# EAGLE design Geogram ONE (EAGLE 6.2)
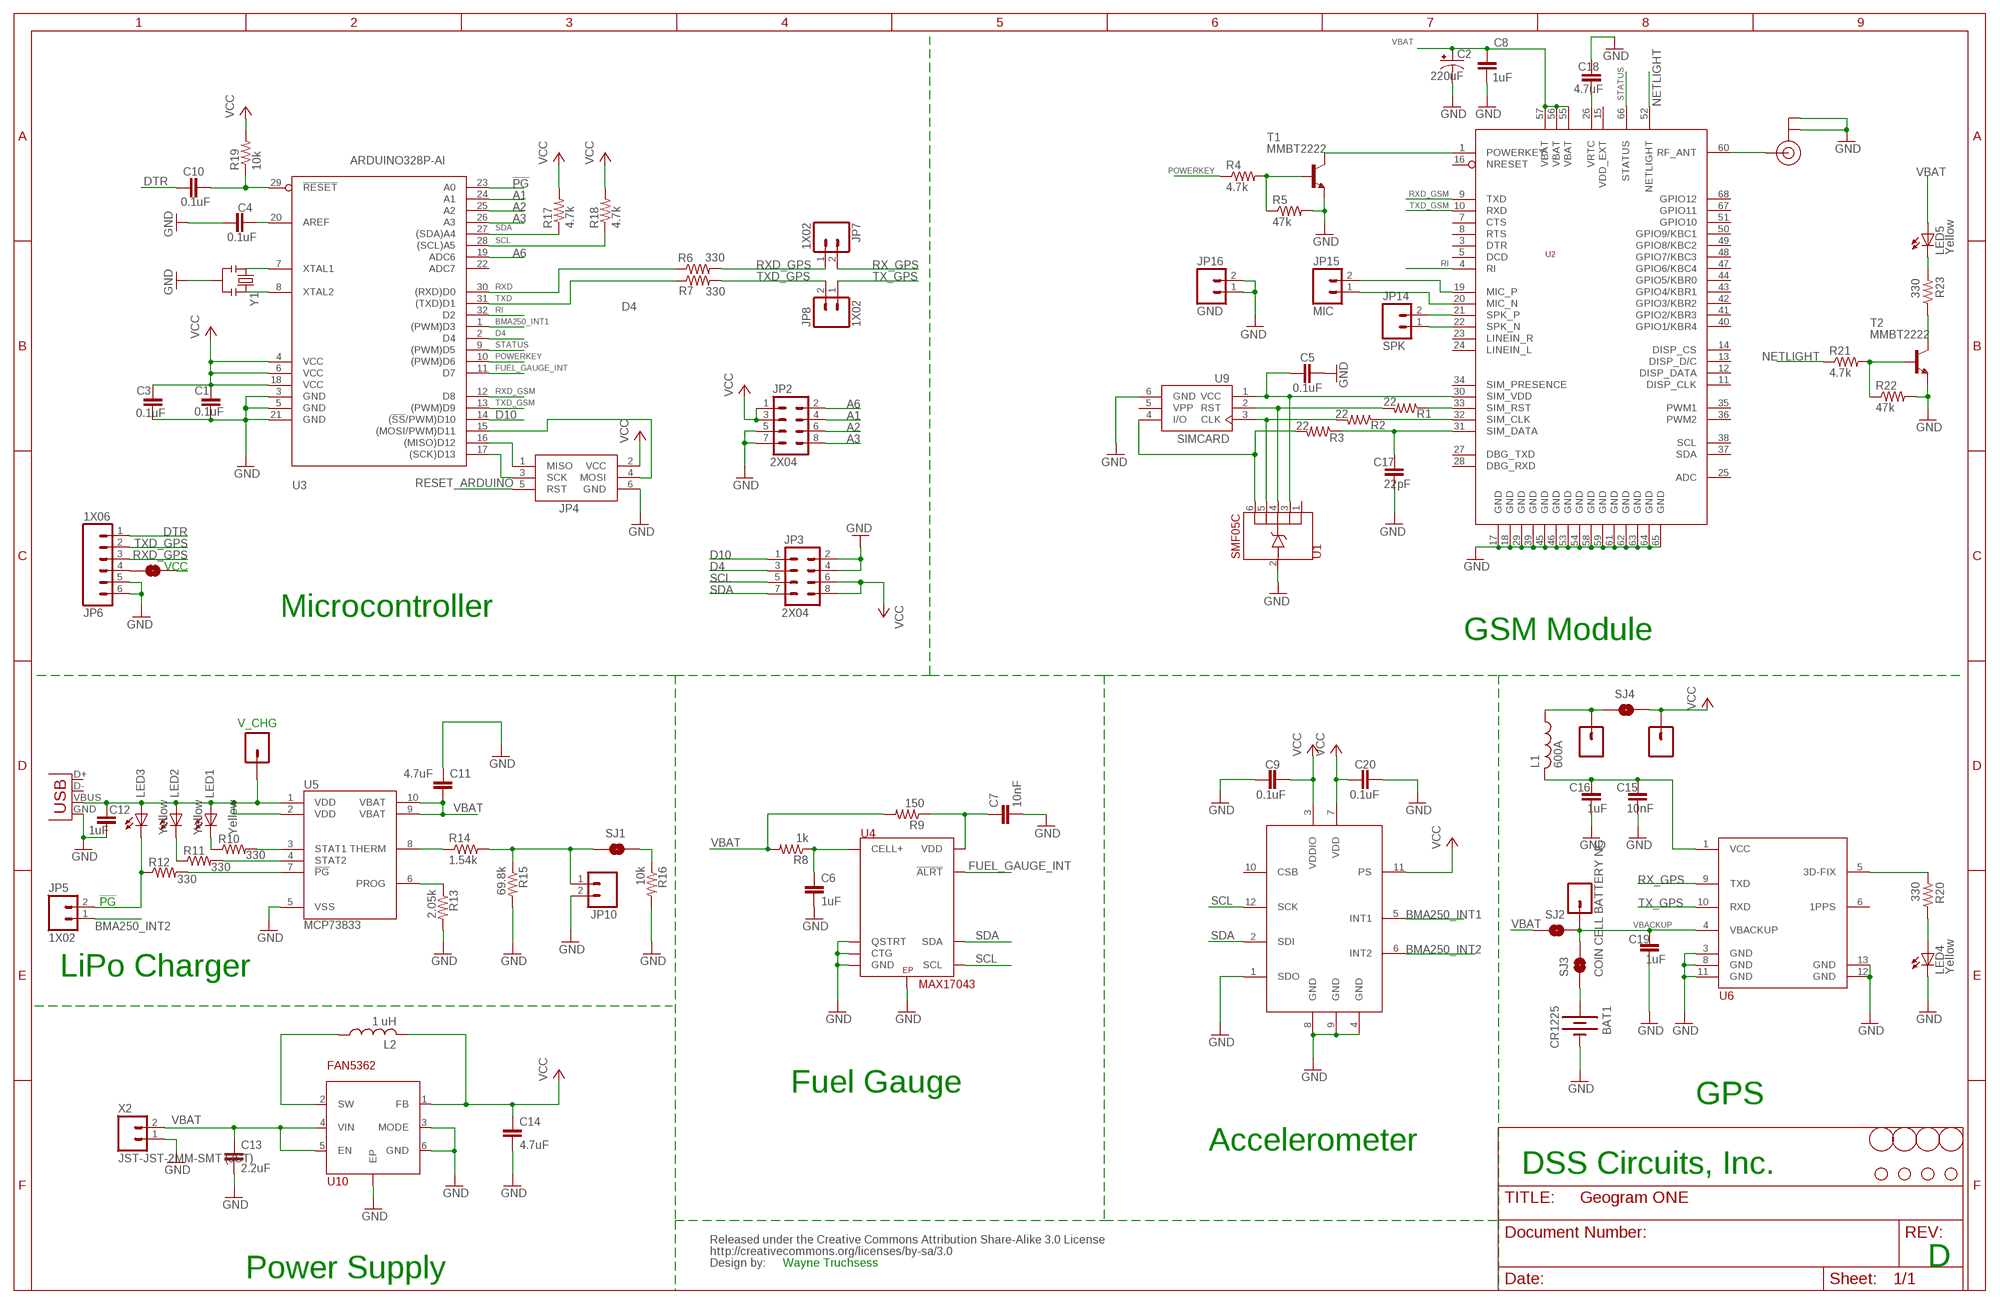
[diagram p0: schematic, sheet 1]

## Parts
BAT1  CR1225  BATTERY12MM  [BATTCON_12MM]
C1  0.1uF  C-EUC0603  [C0603]
C2  220uF  CPOL-USD/7343-31R  [D/7343-31R]
C3  0.1uF  C-EUC0603  [C0603]
C4  0.1uF  C-EUC0603  [C0603]
C5  0.1uF  C-EUC0603  [C0603]
C6  1uF  C-EUC0603  [C0603]
C7  10nF  C-EUC0603  [C0603]
C8  1uF  C-EUC0603  [C0603]
C9  0.1uF  C-EUC0603  [C0603]
C10  0.1uF  C-EUC0603  [C0603]
C11  4.7uF  C-EUC0603  [C0603]
C12  1uF  C-EUC0603  [C0603]
C13  2.2uF  C-EUC0603  [C0603]
C14  4.7uF  C-EUC0603  [C0603]
C15  10nF  C-EUC0603  [C0603]
C16  1uF  C-EUC0603  [C0603]
C17  22pF  C-EUC0603  [C0603]
C18  4.7uF  C-EUC0603  [C0603]
C19  1uF  C-EUC0603  [C0603]
C20  0.1uF  C-EUC0603  [C0603]
FIDUCIAL1  FIDUCIAL  [FIDUCIAL_1MM]
FIDUCIAL2  FIDUCIAL  [FIDUCIAL_1MM]
FIDUCIAL3  FIDUCIAL  [FIDUCIAL_1MM]
FIDUCIAL4  FIDUCIAL  [FIDUCIAL_1MM]
JP2  2X04  M04X2  [2X4]
JP3  2X04  M04X2  [2X4]
JP4  AVRISP-6  [AVRISP]
JP5  1X02  M021X02_NO_SILK  [1X02_NO_SILK]
JP6  1X06  M06SIP  [1X06]
JP7  1X02  M021X02_NO_SILK  [1X02_NO_SILK]
JP8  1X02  M021X02_NO_SILK  [1X02_NO_SILK]
JP9  V_CHG  M01PTH  [1X01]
JP10  EXT THERMISTER  M021X02_NO_SILK  [1X02_NO_SILK]
JP11  EXT_BAT  M01PTH  [1X01]
JP12  EXT GPS POWER JPR  M01PTH  [1X01]
JP13  EXT GPS POWER JPR  M01PTH  [1X01]
JP14  SPK  M021X02_NO_SILK  [1X02_NO_SILK]
JP15  MIC  M021X02_NO_SILK  [1X02_NO_SILK]
JP16  GND  M021X02_NO_SILK  [1X02_NO_SILK]
L1  600A  L-USL2012C  [L2012C]
L2  1 uH  L-USL2012C  [L2012C]
LED1  Yellow  LEDCHIP-LED0603  [CHIP-LED0603]
LED2  Yellow  LEDCHIP-LED0603  [CHIP-LED0603]
LED3  Yellow  LEDCHIP-LED0603  [CHIP-LED0603]
LED4  Yellow  LEDCHIP-LED0603  [CHIP-LED0603]
LED5  Yellow  LEDCHIP-LED0603  [CHIP-LED0603]
LICENSE  CREATIVE_COMMONS  [CREATIVE_COMMONS]
R1  22  R-US_R0603  [R0603]
R2  22  R-US_R0603  [R0603]
R3  22  R-US_R0603  [R0603]
R4  4.7k  R-US_R0603  [R0603]
R5  47k  R-US_R0603  [R0603]
R6  330  R-US_R0603  [R0603]
R7  330  R-US_R0603  [R0603]
R8  1k  R-US_R0603  [R0603]
R9  150  R-US_R0603  [R0603]
R10  330  R-US_R0603  [R0603]
R11  330  R-US_R0603  [R0603]
R12  330  R-US_R0603  [R0603]
R13  2.05k  R-US_R0603  [R0603]
R14  1.54k  R-US_R0603  [R0603]
R15  69.8k  R-US_R0603  [R0603]
R16  10k  R-US_R0603  [R0603]
R17  4.7k  R-US_R0603  [R0603]
R18  4.7k  R-US_R0603  [R0603]
R19  10k  R-US_R0603  [R0603]
R20  330  R-US_R0603  [R0603]
R21  4.7k  R-US_R0603  [R0603]
R22  47k  R-US_R0603  [R0603]
R23  330  R-US_R0603  [R0603]
SJ1  EXT THERMISTER NC  SOLDERJUMPERTRACE  [SJ_2S-TRACE]
SJ2  LIPO BATTERY NO  SOLDERJUMPERNO  [SJ_2S-NO]
SJ3  COIN CELL BATTERY NC  SOLDERJUMPERTRACE  [SJ_2S-TRACE]
SJ4  EXT GPS POWER NC  SOLDERJUMPERTRACE  [SJ_2S-TRACE]
SJ5  EXT VCC NO  SOLDERJUMPERNO  [SJ_2S-NO]
STANDOFF1  STAND-OFF  [STAND-OFF]
STANDOFF2  STAND-OFF  [STAND-OFF]
STANDOFF3  STAND-OFF  [STAND-OFF]
STANDOFF4  STAND-OFF  [STAND-OFF]
T1  MMBT2222  MMBT2222ALT1-NPN-SOT23-BEC  [SOT23-BEC]
T2  MMBT2222  MMBT2222ALT1-NPN-SOT23-BEC  [SOT23-BEC]
U1  SMF05C  [SC70-6L]
U2  SIM900  [SIM900]
U3  ARDUINO328P-AI  [TQFP32-08]
U4  MAX17043  [TDFN8]
U5  MCP73833  [MSOP-10]
U6  PA6C  [PA6C]
U7  BMA250  [12LGA_VGG3-D]
U8  U.FL  [U.FL]
U9  SIMCARD  [SIMCARD]
U10  FAN5362  [UMLP]
X1  USBSMD  [USB-MINIB]
X2  JST-JST-2MM-SMT (JST)  JST-JST-2MM-SMT  [JST]
Y1  8 MHz  RESONATORSMD  [RESONATOR-SMD]

## Nets
!PG: JP5.2 LED3.C R12.1 U3.23(A0)
A1: JP2.4 U3.24(A1)
A2: JP2.6 U3.25(A2)
A3: JP2.8 U3.26(A3)
A6: JP2.2 U3.19(ADC6)
AREF: C4.2 U3.20(AREF)
BMA250_INT1: U3.1((PWM)D3) U7.5(INT1)
BMA250_INT2: JP5.1 U7.6(INT2)
D4: JP3.3 U3.2(D4)
D10: JP3.1 U3.14((!SS!/PWM)D10)
DTR: C10.1 JP6.1
FUEL_GAUGE_INT: U3.11(D7) U4.!ALRT
GND: BAT1.GND(-) C1.2 C2.- C3.2 C4.1 C5.2 C6.2 C7.2 C8.2 C9.2 C11.1 C12.2 C13.2 C14.2 C15.1 C16.1 C17.1 C18.1 C19.1 C20.1 JP2.5 JP2.7 JP3.2 JP3.4 JP4.6(GND) JP6.5 JP6.6 JP10.2 JP16.1 JP16.2 LED4.C R5.2 R13.2 R15.2 R16.2 R22.2 T1.E T2.E U1.2 U2.17(GND) U2.18(GND) U2.29(GND) U2.39(GND) U2.45(GND) U2.46(GND) U2.53(GND) U2.54(GND) U2.58(GND) U2.59(GND) U2.61(GND) U2.62(GND) U2.63(GND) U2.64(GND) U2.65(GND) U3.3(GND) U3.5(GND) U3.21(GND) U4.CTG U4.EP U4.GND U4.QSTRT U5.5(VSS) U6.3(GND) U6.8(GND) U6.11(GND) U6.12(GND) U6.13(GND) U7.1(SDO) U7.4(GND) U7.8(GND) U7.9(GND) U8.P$1(GND) U8.P$2(GND) U9.6(GND) U10.3(MODE) U10.6(GND) U10.7(EP) X1.GND X2.1 Y1.2
MIC_N: JP15.1 U2.20(MIC_N)
MIC_P: JP15.2 U2.19(MIC_P)
MISO: JP4.1(MISO) U3.16((MISO)D12)
MOSI: JP4.4(MOSI) U3.15((MOSI/PWM)D11)
N$2: C18.2 U2.26(VRTC)
N$3: R2.1 U2.32(SIM_CLK)
N$4: R20.2 U6.5(3D-FIX)
N$6: C6.1 R8.1 U4.CELL+
N$7: R1.1 U2.33(SIM_RST)
N$8: C17.2 R3.1 U2.31(SIM_DATA)
N$9: R2.2 U1.5 U9.3(CLK)
N$10: R1.2 U1.4 U9.2(RST)
N$11: R3.2 U1.6 U9.4(I/O)
N$12: LED4.A R20.1
N$13: U2.60(RF_ANT) U8.P$3(SIGNAL)
N$14: T1.C U2.1(POWERKEY)
N$15: R4.2 R5.1 T1.B
N$16: BAT1.PWR@2(+) SJ3.1
N$17: R21.2 R22.1 T2.B
N$18: R23.1 T2.C
N$19: JP6.4 SJ5.2
N$20: C7.1 R9.1 U4.VDD
N$21: LED1.C R10.1
N$22: LED2.C R11.1
N$24: JP12.1 L1.1 SJ4.1 SJ5.1
N$26: R13.1 U5.6(PROG)
N$27: R14.1 U5.8(THERM)
N$28: LED5.C R23.2
N$29: JP10.1 R14.2 R15.1 SJ1.1
N$30: L2.1 U10.2(SW)
N$31: R16.1 SJ1.2
NETLIGHT: R21.1 U2.52(NETLIGHT)
PG: R12.2 U5.7(!PG)
POWERKEY: R4.1 U3.10((PWM)D6)
RESET_ARDUINO: C10.2 JP4.5(RST) R19.1 U3.29(!RESET)
RI: U2.4(RI) U3.32(D2)
RX_GPS: JP7.2 U6.9(TXD)
RXD: R6.1 U3.30((RXD)D0)
RXD_GPS: JP6.3 JP7.1 R6.2
RXD_GSM: U2.9(TXD) U3.12(D8)
SCK: JP4.3(SCK) U3.17((SCK)D13)
SCL: JP3.5 R18.1 U3.28((SCL)A5) U4.SCL U7.12(SCK)
SDA: JP3.7 R17.1 U3.27((SDA)A4) U4.SDA U7.2(SDI)
SIM_VDD: C5.1 U1.3 U2.30(SIM_VDD) U9.1(VCC)
SPK_N: JP14.1 U2.22(SPK_N)
SPK_P: JP14.2 U2.21(SPK_P)
STAT1: R10.2 U5.3(STAT1)
STAT2: R11.2 U5.4(STAT2)
STATUS: U2.66(STATUS) U3.9((PWM)D5)
TX_GPS: JP8.1 U6.10(RXD)
TXD: R7.1 U3.31((TXD)D1)
TXD_GPS: JP6.2 JP8.2 R7.2
TXD_GSM: U2.10(RXD) U3.13((PWM)D9)
VBACKUP: C19.2 JP11.1 SJ2.2 SJ3.2 U6.4(VBACKUP)
VBAT: C2.+ C8.1 C11.2 C13.1 LED5.A R8.2 R9.2 SJ2.1 U2.55(VBAT) U2.56(VBAT) U2.57(VBAT) U5.9(VBAT) U5.10(VBAT) U10.4(VIN) U10.5(EN) X2.2
VBUS: C12.1 JP9.1 LED1.A LED2.A LED3.A U5.1(VDD) U5.2(VDD) X1.VBUS
VCC: C1.1 C3.1 C9.1 C14.1 C20.2 JP2.1 JP2.3 JP3.6 JP3.8 JP4.2(VCC) JP13.1 L2.2 R17.2 R18.2 R19.2 SJ4.2 U3.4(VCC) U3.6(VCC) U3.18(VCC) U7.3(VDDIO) U7.7(VDD) U7.11(PS) U10.1(FB)
VCC_GPS: C15.2 C16.2 L1.2 U6.1(VCC)
XTAL1: U3.7(XTAL1) Y1.1
XTAL2: U3.8(XTAL2) Y1.3
Unconnected: U1.1 U2.2(NC) U2.3(DTR) U2.5(DCD) U2.6(NC) U2.7(CTS) U2.8(RTS) U2.11(DISP_CLK) U2.12(DISP_DATA) U2.13(DISP_D/C) U2.14(DISP_CS) U2.16(NRESET) U2.23(LINEIN_R) U2.24(LINEIN_L) U2.25(ADC) U2.27(DBG_TXD) U2.28(DBG_RXD) U2.34(SIM_PRESENCE) U2.35(PWM1) U2.36(PWM2) U2.37(SDA) U2.38(SCL) U2.40(GPIO1/KBR4) U2.41(GPIO2/KBR3) U2.42(GPIO3/KBR2) U2.43(GPIO4/KBR1) U2.44(GPIO5/KBR0) U2.47(GPIO6/KBC4) U2.48(GPIO7/KBC3) U2.49(GPIO8/KBC2) U2.50(GPIO9/KBC1) U2.51(GPIO10) U2.67(GPIO11) U2.68(GPIO12) U3.22(ADC7) U6.2(NC) U6.6(1PPS) U6.7(NC) U7.10(CSB) X1.D+ X1.D-

## Notes on the sheet
- VCC
- Microcontroller
- GSM Module
- V_CHG
- !PG
- LiPo Charger
- Fuel Gauge
- GPS
- Accelerometer
- DSS Circuits, Inc.
- Wayne Truchsess | D
- Power Supply

## Power pins joined to a net without a drawn wire
VDD_EXT: U2.15(VDD_EXT)
VPP: U9.5(VPP)

## Library data of the parts
BAT1 = SparkFun:BATTERY: Battery Holders Various common sizes : AA, AAA, 20mm coin cell and 12mm coin cell.; DIGIKEY#: 3000KTR-ND; MANF: Keystone Electronics; MANF#: 3000TR; MOUSER#: 534-3000TR
C1 C3-C5 C9 C10 C20 = resistor:C-EU: CAPACITOR, European symbol; DIGIKEY#: 399-1095-2-ND; MANF: Kemet; MANF#: C0603C104K8RACTU; MOUSER#: 80-C0603C104K8R
C2 = resistor:CPOL-US: POLARIZED CAPACITOR, American symbol; DIGIKEY#: 399-4045-2-ND; MANF: Kemet; MANF#: T520D227M010ATE018; MOUSER#: 80-T520D227M010
C6 C8 C12 C16 C19 = resistor:C-EU: CAPACITOR, European symbol; DIGIKEY#: 445-1321-2-ND; MANF: TDK; MANF#: C1608X5R1A105KT; MOUSER#: 810-C1608X5R1A105K
C7 C15 = resistor:C-EU: CAPACITOR, European symbol; MANF: Vishay/Vitramon; MANF#: VJ0603Y103KXQCW1BC; MOUSER#: 77-VJ0603Y103KXQCBC
C11 C14 C18 = resistor:C-EU: CAPACITOR, European symbol; DIGIKEY#: 399-3482-2-ND; MANF: Kemet; MANF#: C0603C475K9PACTU; MOUSER#: 80-C0603C475K9P
C13 = resistor:C-EU: CAPACITOR, European symbol; DIGIKEY#: 399-3362-2-ND; MANF: Kemet; MANF#: C0603C225K9PACTU; MOUSER#: 80-C0603C225K9P
C17 = resistor:C-EU: CAPACITOR, European symbol; MANF: Vishay/Vitramon; MANF#: VJ0603A220KXJPW1BC; MOUSER#: 77-VJ0603A220KXJPBC
FIDUCIAL1-FIDUCIAL4 = adafruit:FIDUCIAL: For use by pick and place machines to calibrate the vision/machine, 1mm By microbuilder.eu
JP2 JP3 = SparkFun:M04X2; MANF: 4Ucon; MANF#: 0991
JP4 = adafruit:AVRISP: AVR ISP HEADER Standard 6 pin header for AVR programming; MANF: 4Ucon; MANF#: 0989
JP5 JP7 JP8 = SparkFun:M02: Header 2 Standard 2-pin 0.1" header. Use with straight break away headers (SKU : PRT-00116), right angle break away headers (PRT-00553), swiss pins (PRT-00743), machine pins (PRT-00117), and female headers (PRT-00115). Molex polarized connector foot print use with SKU : PRT-08233 with associated crimp pins and housings.; MANF: 4Ucon; MANF#: 0795
JP6 = SparkFun:M06: Header 6 Standard 6-pin 0.1" header. Use with straight break away headers (SKU : PRT-00116), right angle break away headers (PRT-00553), swiss pins (PRT-00743), machine pins (PRT-00117), and female headers (PRT-00115). Molex polarized connector foot print use with SKU : PRT-08094 with associated crimp pins and housings. NOTES ON THE VARIANTS LOCK and LOCK_LONGPADS... This footprint was designed to help hold the alignment of a through-hole component (i.e. 6-pin header) while soldering it into place. You may notice that each hole has been shifted either up or down by 0.005 of an inch from it's more standard position (which is a perfectly straight line). This slight alteration caused the pins (the squares in the middle) to touch the edges of the holes. Because they are alternating, it causes a "brace" to hold the component in place. 0.005 has proven to be the perfect amount of "off-center" position when using our standard breakaway headers. Although looks a little odd when you look at the bare footprint, once you have a header in there, the alteration is very hard to notice. Also, if you push a header all the way into place, it is covered up entirely on the bottom side. This idea of altering the position of holes to aid alignment will be further integrated into the Sparkfun Library for other footprints. It can help hold any component with 3 or more connection pins.; MANF: 4Ucon; MANF#: 0808
JP9 JP11-JP13 = SparkFun:M01: Header 1 Standard 1-pin 0.1" header. Use with straight break away headers (SKU : PRT-00116), right angle break away headers (PRT-00553), swiss pins (PRT-00743), machine pins (PRT-00117), and female headers (PRT-00115).
JP10 JP14-JP16 = SparkFun:M02: Header 2 Standard 2-pin 0.1" header. Use with straight break away headers (SKU : PRT-00116), right angle break away headers (PRT-00553), swiss pins (PRT-00743), machine pins (PRT-00117), and female headers (PRT-00115). Molex polarized connector foot print use with SKU : PRT-08233 with associated crimp pins and housings.
L1 = resistor:L-US: INDUCTOR, American symbol; MANF: TDK; MANF#: MMZ2012R601AT; MOUSER#: 810-MMZ2012R601A
L2 = resistor:L-US: INDUCTOR, American symbol; DIGIKEY#: 490-4992-2-ND; MANF: Murata; MANF#: LQM21PN1R0MC0D; MOUSER#: 81-LQM21PN1R0MC0D
LED1-LED5 = led:LED: LED OSRAM: - CHIPLED LG R971, LG N971, LY N971, LG Q971, LY Q971, LO R971, LY R971 LH N974, LH R974 LS Q976, LO Q976, LY Q976 LO Q996 - Hyper CHIPLED LW Q18S LB Q993, LB Q99A, LB R99A - SideLED LS A670, LO A670, LY A670, LG A670, LP A670 LB A673, LV A673, LT A673, LW A673 LH A674 LY A675 LS A676, LA A676, LO A676, LY A676, LW A676 LS A679, LY A679, LG A679 - Hyper Micro SIDELED® LS Y876, LA Y876, LO Y876, LY Y876 LT Y87S - SmartLED LW L88C, LW L88S LB L89C, LB L89S, LG L890 LS L89K, LO L89K, LY L89K LS L896, LA L896, LO L896, LY L896 - TOPLED LS T670, LO T670, LY T670, LG T670, LP T670 LSG T670, LSP T670, LSY T670, LOP T670, LYG T670 LG T671, LOG T671, LSG T671 LB T673, LV T673, LT T673, LW T673 LH T674 LS T676, LA T676, LO T676, LY T676, LB T676, LH T676, LSB T676, LW T676 LB T67C, LV T67C, LT T67C, LS T67K, LO T67K, LY T67K, LW E67C LS E67B, LA E67B, LO E67B, LY E67B, LB E67C, LV E67C, LT E67C LW T67C LS T679, LY T679, LG T679 LS T770, LO T770, LY T770, LG T770, LP T770 LB T773, LV T773, LT T773, LW T773 LH T774 LS E675, LA E675, LY E675, LS T675 LS T776, LA T776, LO T776, LY T776, LB T776 LHGB T686 LT T68C, LB T68C - Hyper Mini TOPLED® LB M676 - Mini TOPLED Santana® LG M470 LS M47K, LO M47K, LY M47K Source: http://www.osram.convergy.de LUXEON: - LUMILED® LXK2-PW12-R00, LXK2-PW12-S00, LXK2-PW14-U00, LXK2-PW14-V00 LXK2-PM12-R00, LXK2-PM12-S00, LXK2-PM14-U00 LXK2-PE12-Q00, LXK2-PE12-R00, LXK2-PE12-S00, LXK2-PE14-T00, LXK2-PE14-U00 LXK2-PB12-K00, LXK2-PB12-L00, LXK2-PB12-M00, LXK2-PB14-N00, LXK2-PB14-P00, LXK2-PB14-Q00 LXK2-PR12-L00, LXK2-PR12-M00, LXK2-PR14-Q00, LXK2-PR14-R00 LXK2-PD12-Q00, LXK2-PD12-R00, LXK2-PD12-S00 LXK2-PH12-R00, LXK2-PH12-S00 LXK2-PL12-P00, LXK2-PL12-Q00, LXK2-PL12-R00 Source: www.luxeon.com KINGBRIGHT: KA-3528ASYC Source: www.kingbright.com; DIGIKEY#: 475-2557-2-ND; MANF: OSRAM Opto Semiconductors; MANF#: LY Q971-H1K1-36; MOUSER#: 720-LYQ971H1K136
LICENSE = SparkFun:CREATIVE_COMMONS
R1-R3 = resistor:R-US_: RESISTOR, American symbol; DIGIKEY#: P22.0HTR-ND; MANF: Panasonic Electronic Components; MANF#: ERJ-3EKF22R0V; MOUSER#: 667-ERJ-3EKF22R0V
R4 R17 R18 R21 = resistor:R-US_: RESISTOR, American symbol; DIGIKEY#: P4.70KHTR-ND; MANF: Panasonic Electronic Components; MANF#: ERJ-3EKF4701V; MOUSER#: 667-ERJ-3EKF4701V
R5 R22 = resistor:R-US_: RESISTOR, American symbol; DIGIKEY#: P47.0KHTR-ND; MANF: Panasonic Electronic Components; MANF#: ERJ-3EKF4702V; MOUSER#: 667-ERJ-3EKF4702V
R6 R7 R10-R12 R20 R23 = resistor:R-US_: RESISTOR, American symbol; DIGIKEY#: P330HTR-ND; MANF: Panasonic Electronic Components; MANF#: ERJ-3EKF3300V; MOUSER#: 667-ERJ-3EKF3300V
R8 = resistor:R-US_: RESISTOR, American symbol; DIGIKEY#: P1.00KHTR-ND; MANF: Panasonic Electronic Components; MANF#: ERJ-3EKF1001V; MOUSER#: 667-ERJ-3EKF1001V
R9 = resistor:R-US_: RESISTOR, American symbol; DIGIKEY#: P150HTR-ND; MANF: Panasonic Electronic Components; MANF#: ERJ-3EKF1500V; MOUSER#: 667-ERJ-3EKF1500V
R13 = resistor:R-US_: RESISTOR, American symbol; DIGIKEY#: P2.05KHTR-ND; MANF: Panasonic Electronic Components; MANF#: ERJ-3EKF2051V; MOUSER#: 667-ERJ-3EKF2051V
R14 = resistor:R-US_: RESISTOR, American symbol; DIGIKEY#: 541-1.54KHTR-ND; MANF: Vishay/Dale; MANF#: CRCW06031K54FKEA; MOUSER#: 71-CRCW0603-1.54K-E3
R15 = resistor:R-US_: RESISTOR, American symbol; DIGIKEY#: P69.8KHTR-ND; MANF: Panasonic Electronic Components; MANF#: ERJ-3EKF6982V; MOUSER#: 667-ERJ-3EKF6982V
R16 R19 = resistor:R-US_: RESISTOR, American symbol; DIGIKEY#: P10.0KHTR-ND; MANF: Panasonic Electronic Components; MANF#: ERJ-3EKF1002V; MOUSER#: 667-ERJ-3EKF1002V
SJ1-SJ5 = SparkFun:SOLDERJUMPER: Solder Jumper Standard SMD solder jumper. Used to automate production. Two varients : Normally Open and Normally Closed are the same, but have different paste layers. NC will have a large amount of paste and should jumper during reflow.
STANDOFF1-STANDOFF4 = DSSCircuits:STAND-OFF: Stand Off This is the mechanical footprint for a #4 phillips button head screw. Use the keepout ring to avoid running the screw head into surrounding components. SKU : PRT-00447
T1 T2 = transistor:*-NPN-: NPN Transistror BF959 corrected 2008.03.06; DIGIKEY#: MMBT2222AFSTR-ND; MANF: Fairchild Semiconductor; MANF#: MMBT2222A; MOUSER#: 512-MMBT2222A
U1 = DSSCircuits:SMF05C; DIGIKEY#: SMF05CTR-ND; MANF: Semtech; MANF#: SMF05C.TCT
U2 = DSSCircuits:SIM900; MANF: Simcom; MANF#: SIM900
U3 = DSSCircuits:ARDUINO328P: MICROCONTROLLER 8 Kbytes FLASH 1 kbytes SRAM 512 bytes EEPROM USART 6-channel 10 bit ADC 2-channel 8 bit ADC; DIGIKEY#: ATMEGA328P-AU-ND; MANF: Atmel; MANF#: ATMEGA328P-AU; MOUSER#: 556-ATMEGA328P-AU
U4 = DSSCircuits:MAX17043: Compact, Low-Cost 1S Fuel Gauges with Low-Battery Alert; DIGIKEY#: MAX17043G+T-ND; MANF: Maxim Integrated Products; MANF#: MAX17043G+T; MOUSER#: 700-MAX17043G+T
U5 = SparkFun:MCP73833: Microchip MCP73833 Stand-alone Linear Li-ion/Li-polymer Charge Management Controller Packages: DFN-10, MSOP-10 Last modified: 8/17/10 Unproven!; DIGIKEY#: MCP73833-FCI/UN-ND; MANF: Microchip Technology; MANF#: MCP73833-FCI/UN; MOUSER#: 579-MCP73833-FCI/UN
U6 = DSSCircuits:PA6C; MANF: GlobalTop Inc.; MANF#: PA6C
U7 = DSSCircuits:BMA250; DIGIKEY#: 828-1023-6-ND; MANF: Bosch Sensortec; MANF#: BMA250
U8 = DSSCircuits:U.FL; DIGIKEY#: 931-1107-2-ND; MANF: Taoglas; MANF#: RECE-20279-001E-01; MOUSER#: 960-RECE20279001E01
U9 = DSSCircuits:SIMCARD; DIGIKEY#: 609-1401-2-ND; MANF: FCI; MANF#: 7111S2015X02LF; MOUSER#: 649-7111S2015X02LF
U10 = DSSCircuits:FAN5362; DIGIKEY#: FAN5362UMP33X-ND; MANF: Fairchild Semiconductor; MANF#: FAN5362UMP33X; MOUSER#: 512-FAN5362UMP33X
X1 = SparkFun:USB: USB Connectors USB-B-PTH is fully proven SKU : PRT-00139 USB-miniB is fully proven SKU : PRT-00587 USB-A-PCB is untested. USB-A-H is throughly reviewed, but untested. Spark Fun Electronics SKU : PRT-00437 USB-B-SMT is throughly reviewed, but untested. Needs silkscreen touching up. USB-A-S has not been used/tested USB-MB-H has not been used/tested; DIGIKEY#: ED2992TR-ND; MANF: On Shore Technology Inc; MANF#: USB-M26FTR
X2 = DSSCircuits:JST: JST SMD Connector; DIGIKEY#: 455-1749-2-ND; MANF: 4Ucon; MANF#: 19108
Y1 = DSSCircuits:RESONATOR: Resonator Small SMD resonator. This is the itty bitty 10/20MHz resonators with built in caps. CSTCE10M0G55 and CSTCE20M0V53. Footprint has been reviewed closely but hasn't been tested yet.; MANF: Murata; MANF#: CSTCE8M00G52Z-R0; MOUSER#: 81-CSTCE8M00G52Z-R0

## Board
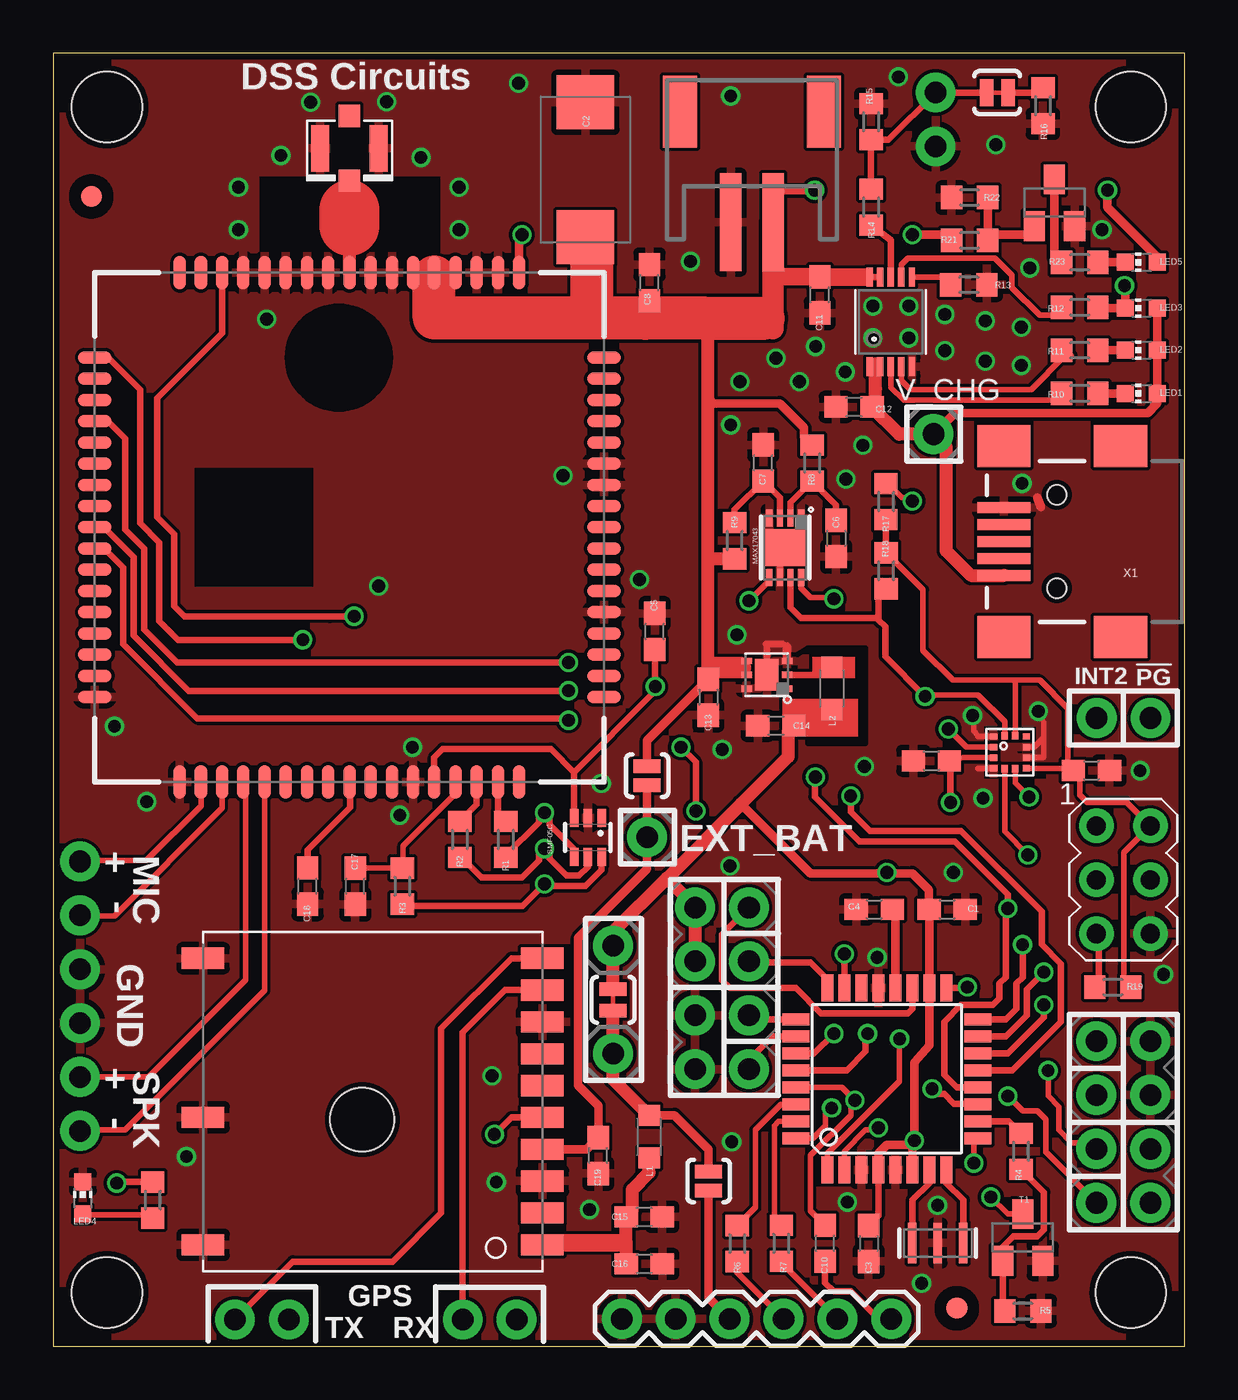
[diagram p1: board, top side]
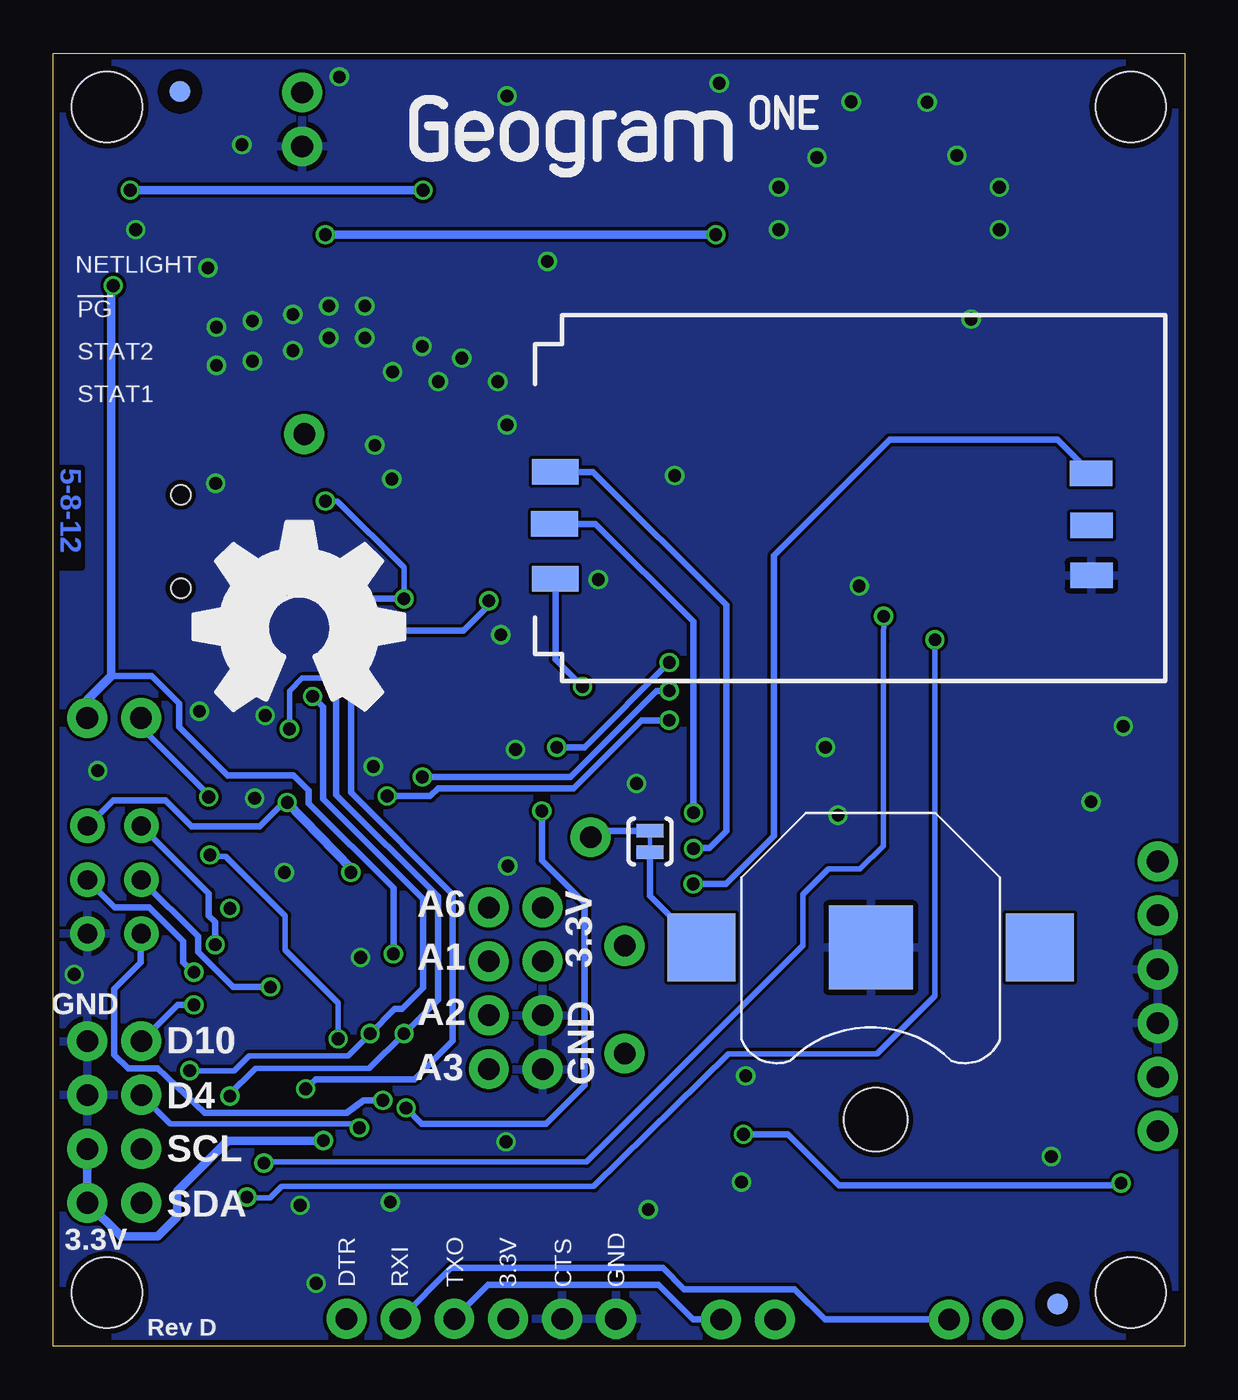
[diagram p2: board, bottom side, seen from below]

Size 53.34 x 60.96 mm. Coordinates in mm from the lower left corner, seen from the top.
Outline: 0,0 53.34,0 53.34,60.96 0,60.96 0,0
Copper layers (1*16): Top 0.035mm / dielectric 1.5mm / Bottom 0.035mm
Design rules: minimum track width 6mil, minimum drill 12mil, track to track 6mil, track to pad 6mil, pad to pad 6mil, via to via 6mil, smd to smd 0mil, copper to edge 10mil, drill to drill 10mil, minimum pad ring 10mil, minimum via ring 6mil, stop-mask expansion 2mil, vias tented up to drill 100mil, thermal gap 10mil
tRestrict: area 9.7,51.6 to 18.2,55.1; 17 lines
bRestrict: 2 lines

### Footprints (pad centres in the part's own frame; a part is rotated, then mirrored left to right if it is on the bottom)
BATTCON_12MM = smd 3.962 x 3.962: GND 0,0 | smd 3.2 x 3.2: PWR@1 -7.974,0; PWR@2 7.974,0
C0603 = smd 1.1 x 1: 1 -0.85,0; 2 0.85,0
D/7343-31R = smd 2.55 x 2.7: + 3.175,0; - -3.175,0
FIDUCIAL_1MM = smd 1 x 1: 1 0,0
2X4 = drill 1.016 pad 1.88: 1 -3.81,-1.27; 2 -3.81,1.27; 3 -1.27,-1.27; 4 -1.27,1.27; 5 1.27,-1.27; 6 1.27,1.27; 7 3.81,-1.27; 8 3.81,1.27
AVRISP = drill 0.9 pad 1.626: 1 -1.27,2.54; 2 1.27,2.54; 3 -1.27,0; 4 1.27,0; 5 -1.27,-2.54; 6 1.27,-2.54
1X02_NO_SILK = drill 1.016 pad 1.88: 1 0,0; 2 2.54,0
1X06 = drill 1.016 pad 1.88: 1 0,0; 2 2.54,0; 3 5.08,0; 4 7.62,0; 5 10.16,0; 6 12.7,0
1X01 = drill 1.016 pad 1.88: 1 0,0
L2012C = smd 1 x 1: 1 -1,0; 2 1,0
CHIP-LED0603 = smd 0.8 x 0.8: A 0,-0.75; C 0,0.75
R0603 = smd 1 x 1.1: 1 -0.85,0; 2 0.85,0
SJ_2S-TRACE = smd 0.635 x 1.27: 1 -0.508,0; 2 0.508,0
SJ_2S-NO = smd 0.635 x 1.27: 1 -0.45,0; 2 0.45,0
STAND-OFF = hole 3.302: 0,0
SOT23-BEC = smd 1 x 1.4: B -0.95,-1.1; C 0,1.1; E 0.95,-1.1
SC70-6L = smd 0.85 x 0.4: 1 -0.925,0.65; 2 -0.925,0; 3 -0.925,-0.65; 4 0.925,-0.65; 5 0.925,0; 6 0.925,0.65
SIM900 = smd 1.6 x 0.6: 1 -12,8; 2 -12,7; 3 -12,6; 4 -12,5; 5 -12,4; 6 -12,3; 7 -12,2; 8 -12,1; 9 -12,0; 10 -12,-1; 11 -12,-2; 12 -12,-3; 13 -12,-4; 14 -12,-5; 15 -12,-6; 16 -12,-7; 17 -12,-8; 35 12,-8; 36 12,-7; 37 12,-6; 38 12,-5; 39 12,-4; 40 12,-3; 41 12,-2; 42 12,-1; 43 12,0; 44 12,1; 45 12,2; 46 12,3; 47 12,4; 48 12,5; 49 12,6; 50 12,7; 51 12,8 | smd 0.6 x 1.6: 18 -8,-12; 19 -7,-12; 20 -6,-12; 21 -5,-12; 22 -4,-12; 23 -3,-12; 24 -2,-12; 25 -1,-12; 26 0,-12; 27 1,-12; 28 2,-12; 29 3,-12; 30 4,-12; 31 5,-12; 32 6,-12; 33 7,-12; 34 8,-12; 52 8,12; 53 7,12; 54 6,12; 55 5,12; 56 4,12; 57 3,12; 58 2,12; 59 1,12; 60 0,12; 61 -1,12; 62 -2,12; 63 -3,12; 64 -4,12; 65 -5,12; 66 -6,12; 67 -7,12; 68 -8,12
TQFP32-08 = smd 1.27 x 0.559: 1 -4.293,2.8; 2 -4.293,2; 3 -4.293,1.2; 4 -4.293,0.4; 5 -4.293,-0.4; 6 -4.293,-1.2; 7 -4.293,-2; 8 -4.293,-2.8; 17 4.293,-2.8; 18 4.293,-2; 19 4.293,-1.2; 20 4.293,-0.4; 21 4.293,0.4; 22 4.293,1.2; 23 4.293,2; 24 4.293,2.8 | smd 0.559 x 1.27: 9 -2.8,-4.293; 10 -2,-4.293; 11 -1.2,-4.293; 12 -0.4,-4.293; 13 0.4,-4.293; 14 1.2,-4.293; 15 2,-4.293; 16 2.8,-4.293; 25 2.8,4.293; 26 2,4.293; 27 1.2,4.293; 28 0.4,4.293; 29 -0.4,4.293; 30 -1.2,4.293; 31 -2,4.293; 32 -2.8,4.293
TDFN8 = smd 0.8 x 0.3: !ALRT 1.4,-0.75; CELL+ -1.4,0.25; CTG -1.4,0.75; GND -1.4,-0.75; QSTRT 1.4,-0.25; SCL 1.4,0.25; SDA 1.4,0.75; VDD -1.4,-0.25 | smd 1.73 x 1.88: EP 0,0
MSOP-10 = smd 0.305 x 0.889: 1 -1,-2.11; 2 -0.5,-2.11; 3 0,-2.11; 4 0.5,-2.11; 5 1,-2.11; 6 1,2.11; 7 0.5,2.11; 8 0,2.11; 9 -0.5,2.11; 10 -1,2.11
PA6C = smd 2 x 1: 1 -8,6.75; 2 -8,5.25; 3 -8,3.75; 4 -8,2.25; 5 -8,0.75; 6 -8,-0.75; 7 -8,-2.25; 8 -8,-3.75; 9 -8,-5.25; 10 -8,-6.75; 11 8,-6.75; 12 8,0.75; 13 8,6.75 | hole 3: 0.5,0.85
12LGA_VGG3-D = smd 0.35 x 0.3: 1 -0.775,0.75; 2 -0.775,0.25; 3 -0.775,-0.25; 4 -0.775,-0.75; 7 0.775,-0.75; 8 0.775,-0.25; 9 0.775,0.25; 10 0.775,0.75 | smd 0.3 x 0.35: 5 -0.25,-0.775; 6 0.25,-0.775; 11 0.25,0.775; 12 -0.25,0.775
U.FL = smd 2.2 x 0.85: P$1 0,1.375; P$2 0,-1.375 | smd 1.05 x 1: P$3 1.525,0; P$4 -1.525,0
SIMCARD = smd 2.2 x 1.2: 1 0.95,4.81; 2 0.91,7.41; 3 0.95,9.86 | smd 2 x 1.2: 4 26.2,9.78; 5 26.22,7.34; 6 26.22,4.98
UMLP = smd 0.3 x 0.5: 1 -0.65,-0.95; 2 0,-0.95; 3 0.65,-0.95; 4 0.65,0.95; 5 0,0.95; 6 -0.65,0.95 | smd 1.5 x 1.1: 7 0,0
USB-MINIB = smd 2.5 x 0.5: D+ 2.5,0; D- 2.5,0.8; GND 2.5,-1.6; ID 2.5,-0.8; VBUS 2.5,1.6 | smd 2.5 x 2: MTN1 -3,4.5; MTN2 2.5,4.5; MTN3 -3,-4.5; MTN4 2.5,-4.5 | hole 0.9: 0,2.2; 0,-2.2
JST = smd 1 x 4.6: 1 -1,-3.7; 2 1,-3.7 | smd 1.6 x 3.4: NC1 -3.4,1.5; NC2 3.4,1.5
RESONATOR-SMD = smd 0.4 x 1.9: 1 -1.2,0; 2 0,0; 3 1.2,0

### Placement (x,y rotation side)
BAT1  14.8,18.8 180 bottom
C1  42.14,20.6 0 top
C2  25.09,55.46 270 top
C3  38.44,4.86 270 top
C4  38.71,20.6 0 top
C5  28.36,33.7 90 top
C6  36.91,38.08 270 top
C7  33.47,41.64 90 top
C8  28.11,50.14 90 top
C9  48.94,27.15 0 top
C10  36.39,4.86 90 top
C11  36.14,49.56 90 top
C12  37.75,44.28 180 top
C13  30.88,30.6 270 top
C14  34.07,29.25 180 top
C15  27.86,6.11 180 top
C16  27.87,3.89 180 top
C17  14.25,21.69 90 top
C18  12,21.7 90 top
C19  25.7,9 90 top
C20  41.4,27.6 0 top
FIDUCIAL1  42.6,1.8 0 top
FIDUCIAL2  1.8,54.2 0 top
FIDUCIAL3  6,2 0 bottom
FIDUCIAL4  47.36,59.15 0 bottom
JP2  31.53,16.88 270 top
JP3  50.45,10.58 270 top
JP4  50.45,22 0 top
JP5  49.19,29.62 0 top
JP6  39.51,1.3 180 top
JP7  21.85,1.27 180 top
JP8  8.57,1.27 0 top
JP9  41.5,43 0 top
JP10  41.6,59.1 270 top
JP11  28,24 0 top
JP12  26.4,13.8 0 top
JP13  26.4,18.88 0 top
JP14  1.27,10.16 90 top
JP15  1.27,20.32 90 top
JP16  1.27,17.78 270 top
L1  28.1,9.89 270 top
L2  36.71,31.01 270 top
LED1  51.3,44.92 90 top
LED2  51.3,46.96 90 top
LED3  51.3,48.94 90 top
LED4  1.4,7 0 top
LED5  51.3,51.1 90 top
LICENSE  2.88,63.58 0 top
R1  21.34,23.9 270 top
R2  19.18,23.89 270 top
R3  16.47,21.69 270 top
R4  45.62,9.2 270 top
R5  45.71,1.67 0 top
R6  32.25,4.85 270 top
R7  34.33,4.86 270 top
R8  35.78,41.63 90 top
R9  32.12,37.98 270 top
R10  48.39,44.92 180 top
R11  48.39,46.95 180 top
R12  48.39,48.97 180 top
R13  43.16,50.04 0 top
R14  38.56,53.7 90 top
R15  38.56,57.72 90 top
R16  46.66,58.48 270 top
R17  39.26,39.82 270 top
R18  39.26,36.56 90 top
R19  49.95,16.94 0 top
R20  4.7,6.9 90 top
R21  43.2,52.13 0 top
R22  43.2,54.15 180 top
R23  48.39,51.1 0 top
SJ1  44.5,59.1 0 top
SJ2  28,26.9 270 top
SJ3  25.2,23.8 90 bottom
SJ4  26.4,16.34 90 top
SJ5  30.9,7.8 270 top
STANDOFF1  50.8,58.42 0 top
STANDOFF2  2.54,58.42 0 top
STANDOFF3  50.8,2.54 0 top
STANDOFF4  2.54,2.54 0 top
T1  45.71,5.14 0 top
T2  47.2,53.9 0 top
U1  25.21,23.99 270 top
U2  13.97,38.61 0 top
U3  39.3,12.61 90 top
U4  34.51,37.65 270 top
U5  39.48,48.29 0 top
U6  15.07,11.55 180 top
U7  45.1,28 0 top
U8  13.97,56.47 270 top
U9  30.61,31.36 0 bottom
U10  33.64,31.66 90 top
U$10  [OSHW_FILLX350_NOTEXT]  46.7,30 0 bottom
U$11  [GEOGRAM_ONE_LOGO]  36.54,55.1 0 bottom
X1  47.32,37.94 180 top
X2  32.94,56.69 0 top
Y1  41.7,4.87 0 top

### Tracks (layer width: path | path; a pad name or v marks a point on that pad's centre or on a via)
!PG  (via drill 0.6)
  Top 0.254: 49.36,48.94 R12.1
  Top 0.305: U3.23 v37.3,18.5
  Top 0.406: 49.36,48.94 LED3.C 50.55,49.95 v50.5,50
  Bottom 0.305: v37.3,18.5 37.3,21.6 41.3,25.6 41.3,26.2 42,26.9 45.1,26.9 47.4,29.2 47.4,30.3 48.7,31.6 50.6,31.6
  Bottom 0.406: v50.5,50 50.6,49.9 50.6,31.6 51.72,30.48 JP5.2
A1
  Top 0.305: U3.24 36.5,17.3 35.7,18.1 32.85,18.1 JP2.4
A2
  Top 0.305: U3.25 33,15.41 JP2.6
A3
  Top 0.305: U3.26 33.91,14.61 33,13.7 33,13.27 JP2.8
A6
  Top 0.305: U3.19 40.5,15.9 40.3,15.7 36.2,15.7 35.01,16.89 31.91,16.89 31.54,17.26 31.54,19.43 JP2.2
AREF
  Top 0.406: U3.20 39.7,20.46 C4.2
BMA250_INT1  (via drill 0.6)
  Top 0.254: U3.1 36.5,9.1 39.9,12.5 v39.9,14.5 | U7.5 44.85,24.27 v45.95,23.17
  Bottom 0.254: v39.9,14.5 39.9,16.2 42.4,18.7 42.4,20.3 45.2,23.1 45.88,23.1 v45.95,23.17
BMA250_INT2  (via drill 0.6)
  Top 0.254: U7.6 45.35,26.55 v46,25.9
  Bottom 0.254: v46,25.9 46,26 49.2,29.2 JP5.1
D4  (via drill 0.6)
  Top 0.254: U3.2 37.3,9.2 38.3,10.2 38.8,10.2 v38.9,10.3
  Bottom 0.254: v38.9,10.3 39.22,10.48 47.82,10.48 47.82,10.49 JP3.3
D10  (via drill 0.6)
  Top 0.305: U3.14 45.01,13.81 46.7,15.5 v46.7,16.1
  Bottom 0.305: v46.7,16.1 47.47,16.1 JP3.1
DTR
  Top 0.305: C10.1 36.39,3.01 36.8,2.6 37.61,2.6 37.61,2.59 39,1.2 39.41,1.2 JP6.1
FUEL_GAUGE_INT  (via drill 0.6)
  Top 0.305: U4.!ALRT 33.76,36.1 v32.8,35.14 | U3.11 43.56,11.44 42.46,11.44 42,11.9 41.67,11.9 v41.43,12.14
  Bottom 0.305: v32.8,35.14 32.8,34.94 34,33.74 38.5,33.74 39.3,32.94 39.3,26.1 34.5,21.3 34.5,14.4 36.3,12.6 40.97,12.6 v41.43,12.14
GND  (via drill 0.6)
  Top 0.254: U7.4 43.59,27.25 | U7.1 43.59,28.75 43.6,28.8 43.4,29 43.4,29.68 v43.34,29.74 | U7.8 46.65,27.75 46.7,27.8 46.7,28.7 | 46.7,28.7 46.7,29.4 v46.44,29.94 | U7.9 46.25,28.25 46.7,28.7
  Top 0.305: U10.7 33.64,33.06 33.6,33.1 34.4,33.1 34.6,33 | 34.6,32.4 U10.3 | U4.QSTRT 34.26,37.4 U4.EP
  Top 0.406: 34.6,33 34.6,32.4 | 46.4,40 46.56,39.56
  other vias: 19.14,54.64 19.14,52.64 8.74,52.64 8.74,54.64 17.34,56.04 10.74,56.14 12.14,58.64 15.72,58.67 31.94,43.44 25.84,26.54 42.04,48.64 15.34,35.84 16.94,28.24 32.24,33.54 31.54,28.14 42.04,46.94 37.34,45.94 38.24,27.34 20.69,12.75 21.94,59.54 31.94,58.94 44.44,56.64 32.38,45.48 24.04,41.05 10.07,48.42 4.42,25.68 2.89,29.23 30.04,51.14 40.94,2.98 16.34,25.04 6.29,8.95 31.91,22.65 38.64,49.04 40.34,49.04 38.64,47.54 40.34,47.54 43.94,48.34 43.94,46.44 45.64,46.24 35.94,47.14 35.18,45.48 34.08,46.58 38.18,42.48 37.38,40.88 41.69,6.65 20.89,7.75 31.99,9.65 39.84,59.84 27.64,36.15 42.44,22.34 38.84,18.34 45.68,40.68 37.44,6.81 51.24,27.14 25.29,6.45 52.34,17.54 49.44,52.64 46.04,50.84 45.64,48.04 43.84,25.84
  pour Top: 0.5,0.5 52.84,0.5 52.84,60.46 0.5,60.46
  pour Bottom: 0.5,0.5 52.84,0.5 52.84,60.46 0.5,60.46
MIC_N
  Top 0.254: U2.20 7.97,25.37 2.9,20.3 1.29,20.3 JP15.1
MIC_P
  Top 0.254: U2.19 6.97,25.47 4.4,22.9 1.31,22.9 JP15.2
MISO  (via drill 0.6)
  Top 0.305: U3.16 44.91,15.41 45.4,15.9 45.4,17.1 45.7,17.4 v45.7,18.94
  Bottom 0.305: v45.7,18.94 45.7,20 46,20.3 46,21.36 JP4.1
MOSI  (via drill 0.6)
  Top 0.305: U3.15 44.91,14.61 45.9,15.6 45.9,16.84 v46.7,17.64
  Bottom 0.305: v46.7,17.64 47.14,18.04 47.2,18.1 47.2,19.1 48.8,20.7 50.42,20.7 JP4.4
N$2
  Top 0.305: C18.2 12,23.4 14,25.4 14,26.58 U2.26
N$3
  Top 0.305: U2.32 19.97,25.54 R2.1
N$4  (via drill 0.6)
  Top 0.305: R20.2 3.25,7.75 v3,7.7 | v20.8,10 21.6,10.8 U6.5
  Bottom 0.305: v20.8,10 18.7,10 16.3,7.6 3.3,7.6 v3,7.7
N$6
  Top 0.305: U4.CELL+ 34.76,39.76 R8.1 36.91,39.66 C6.1
N$7
  Top 0.305: U2.33 20.97,25.12 R1.1
N$8
  Top 0.254: R3.1 16.6,22.67 | R3.1 C17.2 | 18.87,26.11 18.87,25.97 16.5,23.6 16.5,22.57 R3.1
  Top 0.305: U2.31 18.97,26.11 18.87,26.11
N$9  (via drill 0.6)
  Top 0.305: U1.5 25.21,22.61 24.8,22.2 24.2,22.2 23.4,23 23.4,23.22 v23.16,23.46 22.9,23.2 22.9,22.9 22.1,22.1 20.2,22.1 19.26,23.04 R2.2
  Bottom 0.305: U9.3 27.88,41.22 21.6,34.94 21.6,24.3 22.4,23.5 23.12,23.5 v23.16,23.46
N$10  (via drill 0.6)
  Top 0.305: 24.54,23.28 24.54,23.05 U1.4 24.56,23.44 23.4,24.6 23.4,24.92 v23.16,25.16 22.9,24.9 22.9,24.7 21.34,23.14 R1.2
  Bottom 0.305: v23.16,25.16 23.16,34.16 27.76,38.76 U9.2
N$11  (via drill 0.6)
  Top 0.305: R3.2 16.55,20.76 22.13,20.76 v23.17,21.8 23.27,21.7 25.1,21.7 25.86,22.46 U1.6
  Bottom 0.305: U9.4 6.01,42.74 13.9,42.74 19.36,37.28 19.36,24.05 21.62,21.8 v23.17,21.8
N$12
  Top 0.254: R20.1 4.35,6.05 4.2,6.2 1.45,6.2 LED4.A
N$13
  Top 0.61: U2.60 13.97,52.82 | 13.97,53.56 U8.P$3
  Top 2.819: 13.97,52.82 13.97,53.56
N$14  (via drill 0.6)
  Top 0.254: T1.C 45,6.24 v44.2,7.04
  Top 0.305: U2.1 2.04,46.54 2.66,46.54 4.1,45.1 4.1,38.8 5,37.9 5,34.2 5.9,33.3 11.46,33.3 v11.77,33.31
  Bottom 0.254: v11.77,33.31 11.77,16.53 14.5,13.8 21.5,13.8 27.86,7.54 42.56,7.54 43.1,7 44.16,7 v44.2,7.04
N$15
  Top 0.203: T1.B 44.76,4.7
  Top 0.305: 44.76,4.7 45.26,5.2 46.4,5.2 46.7,5.5 46.7,7.27 R4.2 | T1.B 44.76,1.77 R5.1
N$16
  Bottom 0.305: SJ3.1 25.2,21.23 BAT1.PWR@2
N$17
  Top 0.406: R22.1 R21.2 43.93,52.23 44.1,52.4 45.85,52.4 T2.B
N$18
  Top 0.406: T2.C 47.2,51.24 R23.1
N$19
  Top 0.406: SJ5.2 30.9,2.29 JP6.4
N$20
  Top 0.305: R9.1 32.12,39.44 C7.1 34.26,40 U4.VDD
N$21
  Top 0.406: R10.1 LED1.C
N$22
  Top 0.254: R11.1 49.46,46.96
  Top 0.406: 49.46,46.96 LED2.C
N$24
  Top 0.406: 28.18,10.8 L1.1 28.11,10.9 29.3,10.9 30.9,9.3 SJ5.1
  Top 0.61: L1.1 26.4,12.58 JP12.1 SJ4.1
N$26
  Top 0.254: U5.6 41.95,50.4 R13.1
N$27
  Top 0.305: U5.8 39.48,52.13 R14.1
N$28
  Top 0.406: R23.2 LED5.C
N$29
  Top 0.305: SJ1.1 JP10.1 39.37,56.87 R15.1 R14.2
N$30
  Top 0.305: U10.2 36.8,31.66 L2.1
N$31
  Top 0.305: SJ1.2 46.83,59.1
  Top 0.406: 46.83,59.1 R16.1
NETLIGHT  (via drill 0.6)
  Top 0.406: U2.52 21.97,52.27 v22.1,52.4 | R21.1 42.47,52.23 42.3,52.4 v40.5,52.4
  Bottom 0.406: v22.1,52.4 v40.5,52.4
PG
  Top 0.254: U5.7 39.98,50.98 40.3,51.3 44.4,51.3 45.2,50.5 45.2,49.9 46.5,48.6 47.87,48.6 R12.2
POWERKEY
  Top 0.305: U3.10 45.06,10.61 R4.1
RESET_ARDUINO  (via drill 0.6)
  Top 0.254: C10.2 35.7,6.4 35.7,9 37.6,10.9 37.6,11.4 v37.8,11.6 37.19,12.21 U3.29
  Top 0.305: R19.1 49.26,17.14 49.3,17.2 49.3,19.33 JP4.5
  Bottom 0.254: 50.45,16.85 50.4,16.9
  Bottom 0.305: v37.8,11.6 38.7,11.6 39.5,11 46.2,11 48.4,13.1 49.8,13.1 50.45,13.75 50.45,16.85 | 50.4,16.9 49.2,18.1 49.2,19.43 JP4.5
RI  (via drill 0.6)
  Top 0.254: U3.32 35.81,9.81 36.4,10.4 36.4,10.94 v36.7,11.24
  Top 0.305: v24.3,32.24 5.86,32.24 4.3,33.8 4.3,37.6 3.4,38.5 3.4,42.8 2.6,43.6 U2.4 | v30.3,25.24 30.3,27.54 v29.6,28.24
  Bottom 0.305: v29.6,28.24 28.3,28.24 v24.3,32.24 | 36.66,11.2 v36.7,11.24 35.96,10.5 30.1,10.5 28.3,12.3 28.3,20.9 30.3,22.9 v30.3,25.24
RX_GPS
  Top 0.305: JP7.2 19.3,1.28 19.3,14.8 21.3,16.8 U6.9
RXD
  Top 0.254: 35,11.4 U3.30 34.31,11.41 33.1,10.2 33.1,6.55 R6.1
RXD_GPS
  Top 0.305: R6.2 32.25,3.47 JP6.3
  Bottom 0.305: JP7.1 23.17,1.27 24.8,2.9 32.83,2.9 JP6.3
RXD_GSM  (via drill 0.6)
  Top 0.254: U3.12
  Top 0.305: U3.12 43.66,12.14 | U2.9 2.4,38.6 3.8,37.2 3.8,33.5 6.4,30.9 v24.3,30.9 | v35.93,26.84 35.9,26.71 35.9,25.9 38,23.8 42.5,23.8 45,21.3 v45,20.64 44.9,20.6 44.9,17.4 44.6,17.1 44.6,16.4 44.3,16.1 42.8,16.1 42,15.3 42,12.8 42.6,12.2 U3.12
  Bottom 0.305: v35.93,26.84 28.96,26.84 24.9,30.9 v24.3,30.9
SCK  (via drill 0.6)
  Top 0.305: U3.17 43.06,16.9 v43.1,16.94
  Bottom 0.305: v43.1,16.94 44.84,16.94 46.5,18.6 46.5,19.32 JP4.3
SCL  (via drill 0.6)
  Top 0.254: 34.98,12.98 U3.28 34.98,13.04 | U7.12 44.85,29.45 43.6,30.7 41.16,30.7 v41.1,30.64 | v46.9,13 46.9,11.8 47.4,11.3 47.4,10.2 48,9.6 48.89,9.6 JP3.5
  Top 0.305: U3.28 37.41,13.01 38.3,13.9 38.3,14.64 v38.4,14.74 | 38.9,34.24 38.8,34.34 35.25,34.34 34.76,34.83 U4.SCL | v41.1,30.64 39.22,32.52 39.22,33.92 38.9,34.24 | R18.1 39.21,35.71 38.9,35.4 38.9,34.24
  Bottom 0.254: v46.9,13 44.8,13 44.1,13.7 39.44,13.7 v38.4,14.74
  Bottom 0.305: v38.4,14.74 37.24,15.9 36.9,15.9 35.9,16.9 35.9,21.1 40.6,25.8 40.6,30.14 v41.1,30.64
SDA  (via drill 0.6)
  Top 0.254: U3.27 34.98,13.78 | U3.27 34.88,13.94 | U3.27 34.98,13.84 | U4.SDA 35.26,35.74 35.7,35.3 36.66,35.3 v36.8,35.24 | U7.2 43.05,28.25 v42.2,29.1 | R17.1 39.33,40.67 40,40 40.34,40 v40.5,39.84 | v45,11.8 45.7,11.1 46.4,11.1 46.8,10.7 46.8,9.14 46.81,9.14 JP3.7
  Top 0.305: U3.27 35.87,13.81 v36.8,14.74
  Bottom 0.254: v42.2,29.1 42.2,30.9 41.6,31.5 40,31.5 | v45,11.8 45.1,11.8 43.8,13.1 38.44,13.1 v36.8,14.74 | v40.5,39.84 39.94,39.84 36.8,36.7 v36.8,35.24
  Bottom 0.305: v36.8,35.24 38.9,35.24 40,34.14 40,31.5 40,26 35.2,21.2 35.2,16.34 v36.8,14.74
SIM_VDD  (via drill 0.6)
  Top 0.305: U2.30 17.97,27.77 18.36,28.16 23.46,28.16 24.56,27.06 | 24.56,27.06 U1.3 | 24.56,27.06 28.22,30.72 28.22,30.94 v28.38,31.1 28.36,31.12 C5.1
  Bottom 0.305: U9.1 29.66,32.38 v28.38,31.1
SPK_N
  Top 0.254: U2.22 9.97,16.77 3.4,10.2 1.31,10.2 JP14.1
SPK_P
  Top 0.254: JP14.2 4.5,12.7 9.07,17.27 9.07,26.51 U2.21
STAT1
  Top 0.254: 47.41,44.8 R10.2 47.47,44.6 40.1,44.6 39.5,45.2 39.5,46.16 U5.3
STAT2
  Top 0.254: 47.94,46.6 R11.2 47.67,46.67 46.1,45.1 40.4,45.1 39.98,45.52 U5.4
  Top 0.305: R11.2 47.98,46.7
STATUS  (via drill 0.6)
  Top 0.254: 43.93,9.81 U3.9 43.51,9.81 43.4,9.7 v43.4,8.64
  Top 0.305: U2.66 7.97,47.77 4.9,44.7 4.9,39.1 5.7,38.3 5.7,34.9 6.2,34.4 13.04,34.4 v14.19,34.41
  Bottom 0.254: v14.19,34.41 14.2,33.24 14.2,23.6 15.3,22.5 16.8,22.5 18,21.3 18,18.9 28.2,8.7 43.34,8.7 v43.4,8.64
TX_GPS
  Top 0.305: JP8.1 8.67,1.27 8.67,1.37 11.3,4 16,4 18.3,6.3 18.3,15 21.6,18.3 U6.10 | U6.10 23.17,18.3 | U6.10
TXD
  Top 0.254: U3.31 35,10.6 34.2,10.6 34,10.4 34,6.04 R7.1
TXD_GPS
  Top 0.254: JP6.2 36.9,1.37
  Top 0.305: R7.2 34.33,3.94 JP6.2
  Bottom 0.305: JP8.2 16.97,1.27 18.4,2.7 23.6,2.7 24.6,3.7 34.57,3.7 JP6.2
TXD_GSM  (via drill 0.6)
  Top 0.305: U3.13 45.21,13.01 47.5,15.3 47.5,18.04 46.6,18.94 46.6,20.5 42.8,24.3 38.5,24.3 37.6,25.2 v37.6,25.94 | U2.10 2.4,37.6 3.3,36.7 3.3,33.1 6.8,29.6 24.21,29.6 v24.3,29.51
  Bottom 0.305: v37.6,25.94 35.56,25.94 35.2,26.3 28.8,26.3 25.6,29.5 v24.31,29.5 v24.3,29.51
VBACKUP
  Top 0.305: 23.17,9.3 U6.4 23.9,9.3
  Top 0.406: SJ2.2 JP11.1 28,22.5 24.75,19.25 24.75,12.3 25.7,11.35 C19.2 25.15,9.3 23.9,9.3
  Bottom 0.305: SJ3.2 27.93,24.3 JP11.1
VBAT  (via drill 0.6)
  Top 0.254: U5.10 38.2,50.68
  Top 0.305: 30.69,31.66 C13.1 | U2.57 U2.56 U2.55 | U10.5 U10.4 32.75,31.99 32.4,31.99 | 30.88,44.64 31.08,44.44 | 33.93,50.44 34.06,50.31 | 38.26,50.4 38.1,50.4 U5.10 U5.9
  Top 0.406: C13.1 30.8,31.53 | 33.48,48.46 33.73,48.46 33.93,48.26 | 35.48,42.66 R8.2 35.4,42.86 35.4,43.3 34.26,44.44 31.08,44.44 | v35.9,54.5 34.2,54.5 34.1,54.6 34.1,53.14 X2.2 | SJ2.1 28,28.57 C13.1 | LED5.A 52.05,51.35 49.7,53.7 v49.7,54.5
  Top 0.61: 17.97,49.62 17.97,50.4 U2.56 | C8.1 27.92,49.44 27.92,48.46 | C13.1 30.88,37.2 | 30.88,37.2 30.88,44.64 30.88,48.38 30.8,48.46 | C11.2 36.15,50.4 | 34.06,50.31 34.16,50.41 | R9.2 30.95,37.12 30.88,37.2
  Top 0.813: 34.16,50.41 C11.2 | C11.2 38.26,50.4 | C13.1 30.88,31.78 31.2,32.1 31.2,32.08 31.18,32.06 31.21,32.06 31.28,31.99
  Top 1.016: X2.2 33.93,50.44 33.93,48.26 33.93,47.96 | 31.28,31.99 32.4,31.99
  Top 2.032: 17.97,50.4 17.97,48.47 23.07,48.47 25.4,48.47 | 25.4,48.47 27.92,48.46 30.8,48.46 33.48,48.46 | C2.+ 25.4,52.29 25.4,48.47
  Bottom 0.406: v35.9,54.5 v49.7,54.5
VBUS
  Top 0.305: U5.1 38.5,46.16 38.78,46.16 | U5.2 38.96,46.16 38.78,46.16 | 38.76,46.14 38.78,46.16 | X1.VBUS 44.85,36.3
  Top 0.406: LED3.A LED2.A LED1.A 52.05,44.45 51.6,44 42.5,44 JP9.1
  Top 0.61: 38.76,46.32 38.76,46.14 38.77,45.13 38.77,44.55 C12.1 39.88,43 JP9.1 42.1,42.4 42.1,37.5 43.26,36.34 X1.VBUS
VCC  (via drill 0.6)
  Top 0.254: U7.3 42.9,27.75 C20.2 | v42.3,25.64 42.24,25.7 | R19.2 50.46,17.2 50.46,17.89 50.46,23.28 JP4.2 50.61,25.64 48.76,25.64 48.4,26 48.4,26.84 C9.1 | R18.2 41,35.67 41,32.8 42.4,31.4 45.4,31.4 | 45.4,31.4 46.5,31.4 47.84,30.06 47.84,27.4 C9.1 | U7.11 45.35,31.35 45.4,31.4 | U7.7 48.19,27.25 C9.1 | C9.1 47.8,27.34
  Top 0.305: 34.59,29.43 C14.1 34.7,29.23 | U10.1 34.54,31.01 34.54,29.37 34.92,29.37 | U3.4 38.9,6.17 C3.1 | 40.5,9.4 40.4,9.5 | v42.3,25.64 42.3,27.15 C20.2 | R17.2 R18.2
  Top 0.406: C14.1 34.92,29.37 37.3,29.37 L2.2 | U3.6 40.5,9.4 v40.6,9.7 40.6,13.4 41.3,14.2 U3.18 C1.1 41.29,21.51 40.5,22.3 39.34,22.3 v39.3,22.34 | U3.4 38.9,9.1 39.3,9.5 40.4,9.5 | v39.3,22.34 39.24,22.3 35.7,22.3 32.43,25.57 | v39.3,22.34 39.34,22.2
  Top 0.61: 28.93,22.07 29.86,21.14 29.86,21.09 JP2.1 JP2.3 | 28.93,22.07 32.43,25.57 34.66,27.8 34.66,28.99 C14.1 | 28.93,22.07 26.39,19.54 26.39,18.96 JP13.1 SJ4.2
  Bottom 0.305: v42.3,25.64 42.46,25.64 43.6,24.5 46.8,24.5 48.04,25.74 50.51,25.74 JP4.2
  Bottom 0.406: v39.3,22.34 39.3,22.54 v42.3,25.64 | v40.6,9.7 45.1,9.7 47.5,7.3 47.5,6.1 48.4,5.2 50.16,5.2 50.16,5.21 JP3.8 JP3.6
VCC_GPS
  Top 0.305: 23.17,4.9 U6.1
  Top 0.61: C15.2 27.01,4.89 26.9,4.9 27,4.91 C16.2 | L1.2 28.1,8.2 27.3,7.4 27.3,6.4 C15.2 | C15.2 27.1,6.32
  Top 0.813: 23.17,4.9 26.9,4.9
XTAL1
  Top 0.305: Y1.1 40.5,6.9 41.3,7.7 U3.7
XTAL2
  Top 0.305: Y1.3 42.91,6.9 42.11,7.7 U3.8
(copper drawn outside any net)
  shapes: Top area x2

### Text on the board
Bottom: 5-8-12
tPlace: DSS Circuits | V_CHG | INT2 | !PG | + | - | + | - | GPS | TX | RX
bPlace: NETLIGHT | !PG | STAT2 | STAT1 | 3.3V | A6 | A1 | GND | GND | A2 | A3 | D10 | D4 | SCL | SDA | 3.3V | GND | CTS | 3.3V | TXO | RXI | DTR | Rev D
Measures: 2.1 " | (53.34mm) | diameter | 0.13" | (3.3mm) | 2.2 " | 2.4 " | (55.88mm) | Not Mounting Holes | (60.96mm) | Not a Mounting Hole | 1.9 " | (48.26mm)
Document: Wayne Truchsess